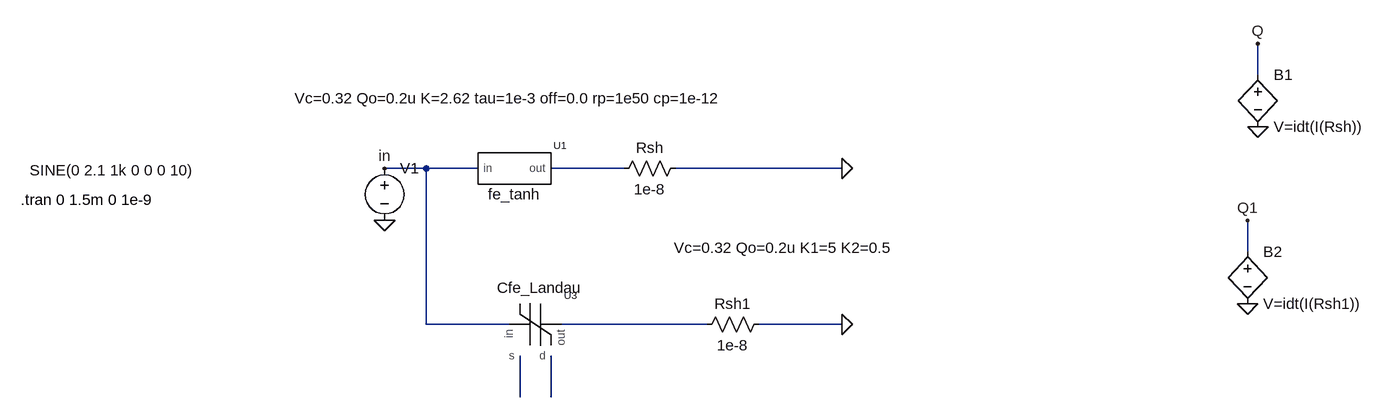
[diagram p0: schematic Fe_test.asc]
Fe_test.asc, the LTspice schematic file:
Version 4
SHEET 1 1180 680
WIRE 992 -160 992 -208
WIRE -288 -16 -352 -16
WIRE -208 -16 -288 -16
WIRE 16 -16 -96 -16
WIRE 352 -16 96 -16
WIRE 976 112 976 64
WIRE -288 224 -288 -16
WIRE -160 224 -288 224
WIRE 144 224 -80 224
WIRE 352 224 224 224
WIRE -144 336 -144 272
WIRE -96 336 -96 272
FLAG 352 -16 0
FLAG -352 64 0
FLAG 992 -80 0
FLAG 992 -208 Q
FLAG -352 -16 in
FLAG 352 224 0
FLAG 976 192 0
FLAG 976 64 Q1
SYMBOL voltage -352 -32 R0
WINDOW 123 0 0 Left 0
WINDOW 39 0 0 Left 0
WINDOW 3 -546 19 Left 2
SYMATTR Value SINE(0 2.1 1k 0 0 0 10)
SYMATTR InstName V1
SYMBOL res 0 0 R270
WINDOW 0 32 56 VTop 2
WINDOW 3 0 56 VBottom 2
SYMATTR InstName Rsh
SYMATTR Value 1e-8
SYMBOL bv 992 -176 R0
SYMATTR InstName B1
SYMATTR Value V=idt(I(Rsh))
SYMBOL res 128 240 R270
WINDOW 0 32 56 VTop 2
WINDOW 3 0 56 VBottom 2
SYMATTR InstName Rsh1
SYMATTR Value 1e-8
SYMBOL bv 976 96 R0
SYMATTR InstName B2
SYMATTR Value V=idt(I(Rsh1))
SYMBOL fe_tanh -160 -16 R0
SYMATTR SpiceLine Vc=0.32 Qo=0.2u K=2.62 tau=1e-3 off=0.0 rp=1e50 cp=1e-12
SYMATTR InstName U1
SYMBOL Cfe_Landau -48 272 R0
SYMATTR SpiceLine Vc=0.32 Qo=0.2u K1=5 K2=0.5
SYMATTR InstName U3
TEXT -912 32 Left 2 !.tran 0 1.5m 0 1e-9

The netlist it stands for:
* Fe_test.asc
V1 in 0 SINE(0 2.1 1k 0 0 0 10)
Rsh N001 0 1e-8
B1 Q 0 V=idt(I(Rsh))
Rsh1 N002 0 1e-8
B2 Q1 0 V=idt(I(Rsh1))
XU1 in N001 fe_tanh Vc=0.32 Qo=0.2u K=2.62 tau=1e-3 off=0.0 rp=1e50 cp=1e-12  ; pins in out
XU3 in N002 N003 N004 Cfe_Landau Vc=0.32 Qo=0.2u K1=5 K2=0.5  ; pins in out s d
.tran 0 1.5m 0 1e-9
.lib C:\Users\MBX\Desktop\Investigacion\Spice-LK-Model\Fe_model\fe_tanh_ni.sp
.lib C:\Users\MBX\Desktop\Investigacion\FeFET-Neuron\Neuron\Cfe_Landau.sp
.backanno
.end